# EAGLE schematic eurorack-midi-controller (EAGLE 9.1.2)
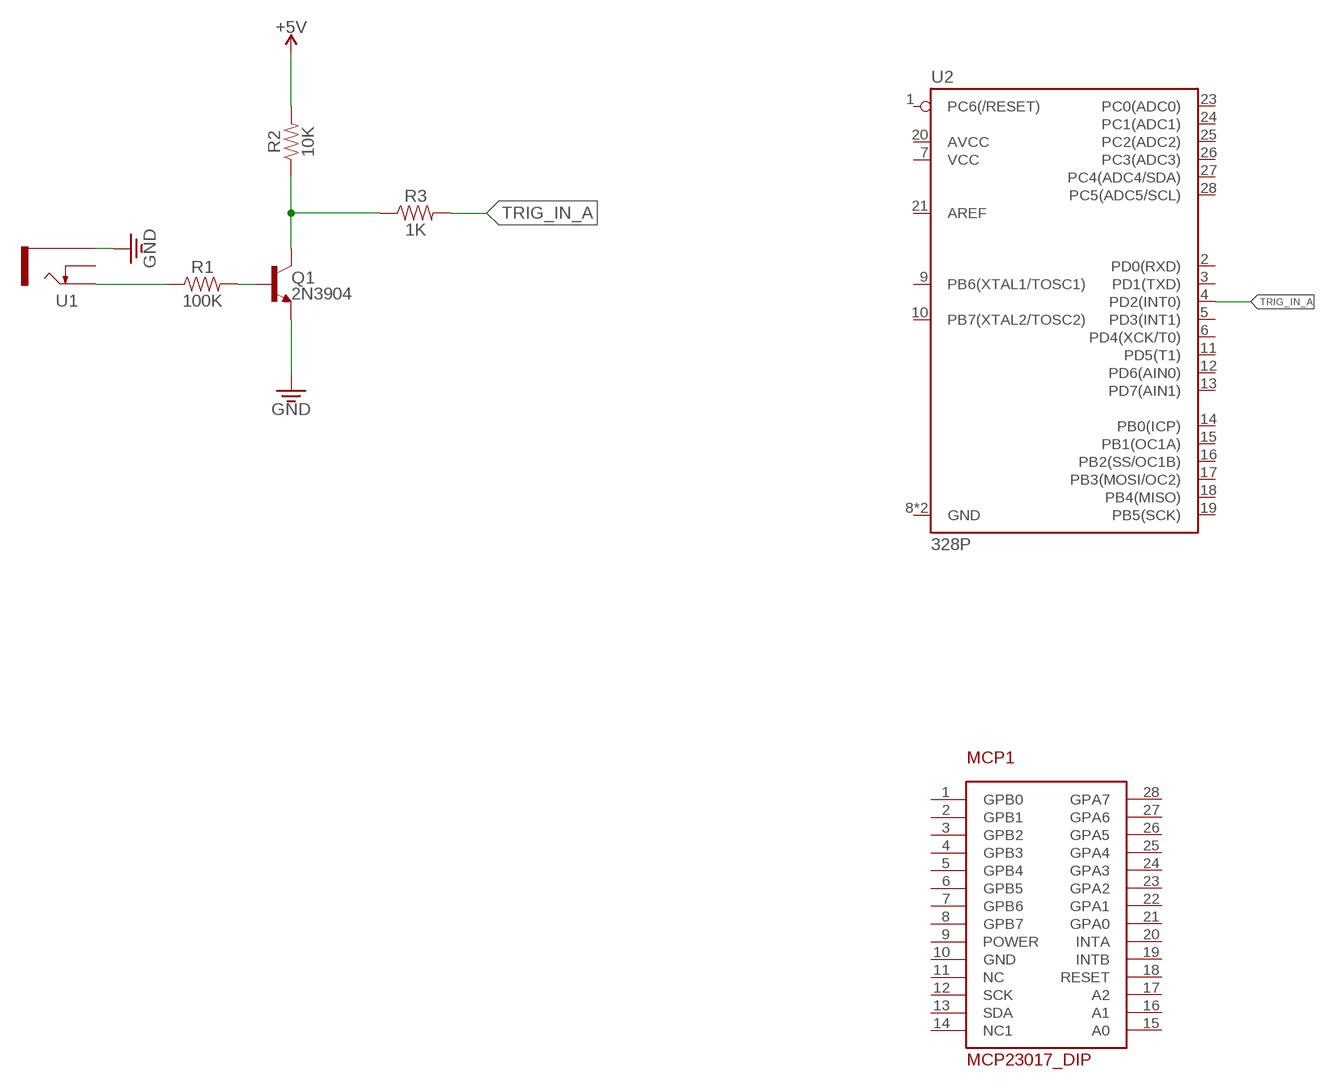
[diagram p0: schematic, sheet 1]

## Parts
MCP1  MCP23017_DIP  [DIP28]
Q1  2N3904  TRANS_NPN-2N3904  [TO-92]
R1  100K  RESISTOR_HORZ  [HORIZONTAL_RESISTOR]
R2  10K  RESISTOR_HORZ  [HORIZONTAL_RESISTOR]
R3  1K  RESISTOR_HORZ  [HORIZONTAL_RESISTOR]
U1  THONKICONNNEW  [WQP-PJ301M-12_JACK]
U2  328P  ATMEGA328P_PDIP  [DIP28]

## Nets
3.3V: Q1.1(E) U1.P$3_SLEEVE(SLEEVE) ; supply symbol labelled GND
5V: R2.2 ; supply symbol labelled +5V
N$1: R1.1 U1.P$1_TIP(TIP)
N$2: Q1.2(B) R1.2
N$3: Q1.3(C) R2.1 R3.1
TRIG_IN_A: R3.2 U2.4(PD2(INT0))
Unconnected: MCP1.1(GPB0) MCP1.2(GPB1) MCP1.3(GPB2) MCP1.4(GPB3) MCP1.5(GPB4) MCP1.6(GPB5) MCP1.7(GPB6) MCP1.8(GPB7) MCP1.9(POWER) MCP1.10(GND) MCP1.11(NC) MCP1.12(SCK) MCP1.13(SDA) MCP1.14(NC1) MCP1.15(A0) MCP1.16(A1) MCP1.17(A2) MCP1.18(RESET) MCP1.19(INTB) MCP1.20(INTA) MCP1.21(GPA0) MCP1.22(GPA1) MCP1.23(GPA2) MCP1.24(GPA3) MCP1.25(GPA4) MCP1.26(GPA5) MCP1.27(GPA6) MCP1.28(GPA7) U1.P$2_SWITCH(SWITCH) U2.1(PC6(/RESET)) U2.2(PD0(RXD)) U2.3(PD1(TXD)) U2.5(PD3(INT1)) U2.6(PD4(XCK/T0)) U2.7(VCC) U2.8(GND) U2.9(PB6(XTAL1/TOSC1)) U2.10(PB7(XTAL2/TOSC2)) U2.11(PD5(T1)) U2.12(PD6(AIN0)) U2.13(PD7(AIN1)) U2.14(PB0(ICP)) U2.15(PB1(OC1A)) U2.16(PB2(SS/OC1B)) U2.17(PB3(MOSI/OC2)) U2.18(PB4(MISO)) U2.19(PB5(SCK)) U2.20(AVCC) U2.21(AREF) U2.22(GND) U2.23(PC0(ADC0)) U2.24(PC1(ADC1)) U2.25(PC2(ADC2)) U2.26(PC3(ADC3)) U2.27(PC4(ADC4/SDA)) U2.28(PC5(ADC5/SCL))

## Library data of the parts
MCP1 = ESSY:MCP23017_DIP
Q1 = SparkFun-DiscreteSemi:TRANS_NPN: NPN transistor Current controlled devices typically used to amplify current or used as a switch. BC547 - COM-08928 <http://www.sparkfun.com/products/8928> (TO-92 45V 100mA) (1.Collector 2.Base 3.Emitter) 2N3904 - COM-00521 <http://www.sparkfun.com/products/521> (TO-92 40V 200mA) (1.Emitter 2.Base 3.Collector) P2N2222A - COM-12852 <http://www.sparkfun.com/products/12852> (TO-92 40V 600mA) (1.Collector 2.Base 3.Emitter); PROD_ID: TRANS-08447; VALUE: 200mA/40V
R1-R3 = ESSY:RESISTOR_HORZ
U1 = MusicThingModular:THONKICONN: 3.5mm socket for Eurorack modular synths
U2 = SparkFun-IC-Microcontroller:ATMEGA328P_PDIP: Atmel 328P Through hole ATMEGA328P uC used in the Arduino 32kb flash, 1k EEPROM, 2k SRAM Datasheet <http://www.sparkfun.com/datasheets/Components/SMD/ATMega328.pdf> SparkFun Products Storefront component: AVR 28 Pin 20MHz 32K 6A/D - ATMega328P <https://www.sparkfun.com/products/9061> (COM-09061) SparkFun Simon Says - Through-Hole Soldering Kit <https://www.sparkfun.com/products/10547> (KIT-10547) SparkFun Learn to Solder - Simon Says <https://www.sparkfun.com/products/13708> (KIT-13708) SparkFun BigTime Watch Kit <https://www.sparkfun.com/products/11734> (KIT-11734) SparkFun ClockIt <https://www.sparkfun.com/products/10930> (KIT-10930) SparkFun Serial Enabled LCD Kit <https://www.sparkfun.com/products/10097> (LCD-10097) SparkFun Simon Tilts - Through Hole Soldering Kit <https://www.sparkfun.com/products/12634> (KIT-12634) SparkFun Frequency Counter Kit <https://www.sparkfun.com/products/10140> (KIT-10140) FabFM Radio Kit <https://www.sparkfun.com/products/11043> (KIT-11043) SparkFun Binary Blaster Kit <https://www.sparkfun.com/products/12037> (KIT-12037) SparkFun Metro-Gnome <https://www.sparkfun.com/products/9236> (KIT-09236) ATmega328 with Arduino Optiboot (Uno) <https://www.sparkfun.com/products/10524> (DEV-10524); PROD_ID: IC-09136